# Altium schematic sheet Schematic2.SchDoc
size A4
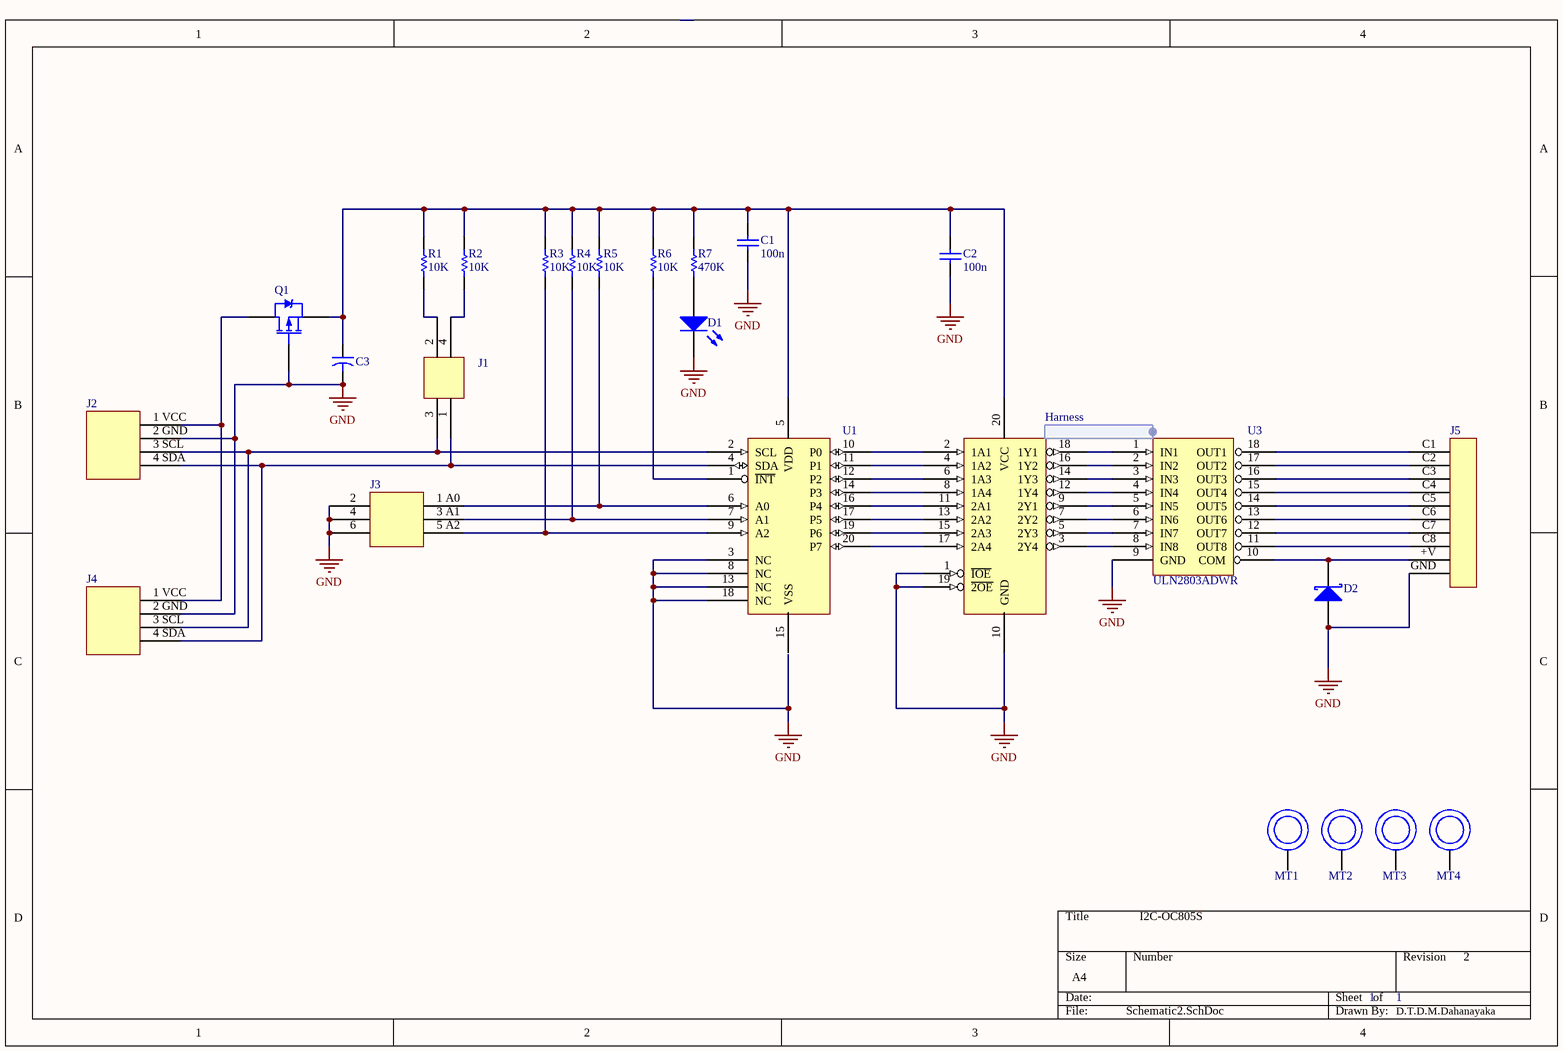
[diagram p0: Schematic2.SchDoc]

## Parts
*  U1
C1  value 100n  [RAD-0.3]  (hidden comment: Cap)
C2  value 100n  [RAD-0.3]  (hidden comment: Cap)
C3  Cap2  [CAPR5-4X5]  (value not drawn)
D1  LED1  [LED-1]  (value not drawn)
D2  Diode 10TQ035  [TO-220AC]  (value not drawn)
J1  Component_1  (value not drawn)
J2  Component_1  (value not drawn)
J3  Component_1  (value not drawn)
J4  Component_1  (value not drawn)
J5  Component_1  (value not drawn)
MT1  Component_1  (value not drawn)
MT2  (no value)
MT3  (no value)
MT4  (no value)
Q1  PMOS-2  [TO-220AB]  (value not drawn)
R1  10K  [AXIAL-0.3]
R2  10K  [AXIAL-0.3]
R3  10K  [AXIAL-0.3]
R4  10K  [AXIAL-0.3]
R5  10K  [AXIAL-0.3]
R6  10K  [AXIAL-0.3]
R7  470K  [AXIAL-0.3]
U2  (no value)
U3  ULN2803ADWR

## Harnesses
Harness: 

## Nets
GND: *.3(NC) *.8(NC) *.13(NC) *.18(NC) C1.2 C2.2 C3.2 D1.2(K) D2.3(A) J2.2_GND J3.2 J3.4 J3.6 J4.2_GND J5.GND Q1.1(G) U2.1(~{IOE}) U2.10(GND) U2.19(~{2OE}) U3.9(GND)
Net*_1: *.1(~{INT}) R6.1
Net*_2: *.2(SCL) J1.3 J2.3_SCL J4.3_SCL
Net*_4: *.4(SDA) J1.1 J2.4_SDA J4.4_SDA
Net*_5: *.5(VDD) C1.1 C2.1 C3.1 Q1.3(S) R1.2 R2.2 R3.2 R4.2 R5.2 R6.2 R7.2 U2.20(VCC)
Net*_6: *.6(A0) J3.1_A0 R5.1
Net*_7: *.7(A1) J3.3_A1 R4.1
Net*_9: *.9(A2) J3.5_A2 R3.1
Net*_10: *.10(P0) U2.2(1A1)
Net*_11: *.11(P1) U2.4(1A2)
Net*_12: *.12(P2) U2.6(1A3)
Net*_14: *.14(P3) U2.8(1A4)
Net*_16: *.16(P4) U2.11(2A1)
Net*_17: *.17(P5) U2.13(2A2)
Net*_19: *.19(P6) U2.15(2A3)
Net*_20: *.20(P7) U2.17(2A4)
NetD1_1: D1.1(A) R7.1
NetD2_1: D2.1(K) J5.+V U3.10(COM)
NetJ1_2: J1.2 R1.1
NetJ1_4: J1.4 R2.1
NetJ2_1 VCC: J2.1_VCC J4.1_VCC Q1.2(D)
NetJ5_C1: J5.C1 U3.18(OUT1)
NetJ5_C2: J5.C2 U3.17(OUT2)
NetJ5_C3: J5.C3 U3.16(OUT3)
NetJ5_C4: J5.C4 U3.15(OUT4)
NetJ5_C5: J5.C5 U3.14(OUT5)
NetJ5_C6: J5.C6 U3.13(OUT6)
NetJ5_C7: J5.C7 U3.12(OUT7)
NetJ5_C8: J5.C8 U3.11(OUT8)
NetU2_3: U2.3(2Y4) U3.8(IN8)
NetU2_5: U2.5(2Y3) U3.7(IN7)
NetU2_7: U2.7(2Y2) U3.6(IN6)
NetU2_9: U2.9(2Y1) U3.5(IN5)
NetU2_12: U2.12(1Y4) U3.4(IN4)
NetU2_14: U2.14(1Y3) U3.3(IN3)
NetU2_16: U2.16(1Y2) U3.2(IN2)
NetU2_18: U2.18(1Y1) U3.1(IN1)

Not connected (* = marked no-connect by the designer): * 15(VSS); MT1 ?1; MT2 ?1; MT3 ?1; MT4 ?1

## Notes on the sheet
- I2C-OC805S
- 1
- 2
- D.T.D.M.Dahanayaka

## Library data of the parts
* MT2-MT4 U2 U3 = Component_1
C1 C2 = Cap: Capacitor; Published: 8-Jun-2000; LatestRevisionDate: 17-Jul-2002; LatestRevisionNote: Re-released for DXP Platform.; PackageReference: RAD-0.3; Publisher: Altium Limited; PackageDescription: Radial Cap, Thru-Hole; 2 Leads; 0.3 in Pin Spacing
C3 = Cap2: Capacitor; Published: 23-Sep-2002; PackageReference: CAPR5-4X5; Publisher: Altium Limited; PackageDescription: Capacitor; 2 Leads
D1 = LED1: Typical RED GaAs LED; Published: 8-Jun-2000; LatestRevisionDate: 08-Jul-2005; LatestRevisionNote: Mech Layer 1 removed.; PackageReference: LED-1; Publisher: Altium Limited; PackageDescription: LED; 2 Leads
D2 = Diode 10TQ035: Schottky Rectifier; Note: Terminal 2 is the TAB and is electrically connected to the cathode; Published: 8-Jun-2000; LatestRevisionDate: 17-Jul-2002; LatestRevisionNote: Re-released for DXP Platform.; DatasheetVersion: PD-2.057B; PackageVersion: Feb-1998; PackageReference: TO-220AC; Publisher: Altium Limited; PackageDescription: TO, Thru-Hole, Vertical, Heatsink Mounted; 3 In-Line Leads (1 Absent); Pitch 2.54 mm; ComponentLink1Description: Manufacturer Link; ComponentLink1URL: http://www.irf.com/; ComponentLink2Description: Datasheet; ComponentLink2URL: http://www.irf.com/product-info/datasheets/data/10tq.pdf
Q1 = PMOS-2: P-Channel Power MOSFET; Note: Pin 4 not drawn and electrically connected to Pin 2.; Published: 8-Jun-2000; LatestRevisionDate: 17-Jul-2002; LatestRevisionNote: Re-released for DXP Platform.; DatasheetVersion: PD-9.390D; PackageVersion: Feb-1997; PackageReference: TO-220AB; Publisher: Altium Limited; PackageDescription: TO, Thru-Hole, Vertical, Heatsink Mounted; 3 In-Line Leads; Pitch 2.54 mm; ComponentLink1Description: Manufacturer Link; ComponentLink1URL: http://www.irf.com/
R1-R7 = Res1: Resistor; Published: 8-Jun-2000; LatestRevisionDate: 17-Jul-2002; LatestRevisionNote: Re-released for DXP Platform.; PackageReference: AXIAL-0.3; Publisher: Altium Limited; PackageDescription: Axial Device, Thru-Hole; 2 Leads; 0.3 in Pin Spacing